# Altium schematic sheet 1_P1.schdoc
size 307 x 218 mm; Symbol: Drawing-Symbol_A4; Device: Drawing-Symbol_A4; @Project Name: Example Project; @Page Count: 1; @Update Date: 2025-08-04; @Create Date: 2025-08-04; @Schematic Name: Schematic1; @Page No: 1; @Page Name: P1; Company: EasyEDA.com; Version: V1.0; Page Size: A4; @Create Time: 15:54:22; @Update Time: 20:54:22; Width: 1170; Height: 825; Region Start: 1; X Region Count: 6; Y Region Count: 4; Blade Width: 10; Title Block Position: 3; @Board Name: Board1
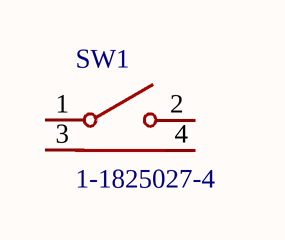
[diagram p0: 1_P1.schdoc]

## Parts
SW1  1-1825027-4  [SW-TH_1-1825027-4]

## Nets

Not connected (* = marked no-connect by the designer): SW1 1 2 3 4

## Notes on the sheet
- 1
- 2
- 3
- 4
- 5
- 6
- A
- B
- C
- Schematic
- Schematic1
- Create at
- Update at
- 2025-08-04
- Board
- Drawn
- Board1
- Page
- P1
- D
- Reviewed
- Version
- Size
- Example Project
- Page  1  Total  1
- V1.0
- A4
- EasyEDA.com

## Library data of the parts
SW1 = 1-1825027-4: Manufacturer: TE Connectivity(泰科电子); Add into BOM: yes; Circuit: SPST; Actuator Style: Round Button; Operating Force: 160gf; Strike Gundam: 带支架; Contact Current: 50mA; Voltage Rating (DC): 24V; Insulation Resistance: 100MΩ; Pin Style: PCPin; Mechanical Life: 10万次; Symbol: 1-1825027-4; Device: 1-1825027-4; LCSC Part Name: 1-1825027-4; Supplier Part: C2928195; Manufacturer Part: 1-1825027-4; Supplier Footprint: 插件; JLCPCB Part Class: Extended Part; Datasheet: https://atta.szlcsc.com/upload/public/pdf/source/20211215/FF245F5A0DC666BCCC97D344C4AB1176.pdf; Supplier: LCSC; Convert to PCB: yes; Mounting Style: Lying; Operating Temperature: -20℃~+105℃